# Altium project RheoBoard_v7.PrjPcb (part 2 of 2)
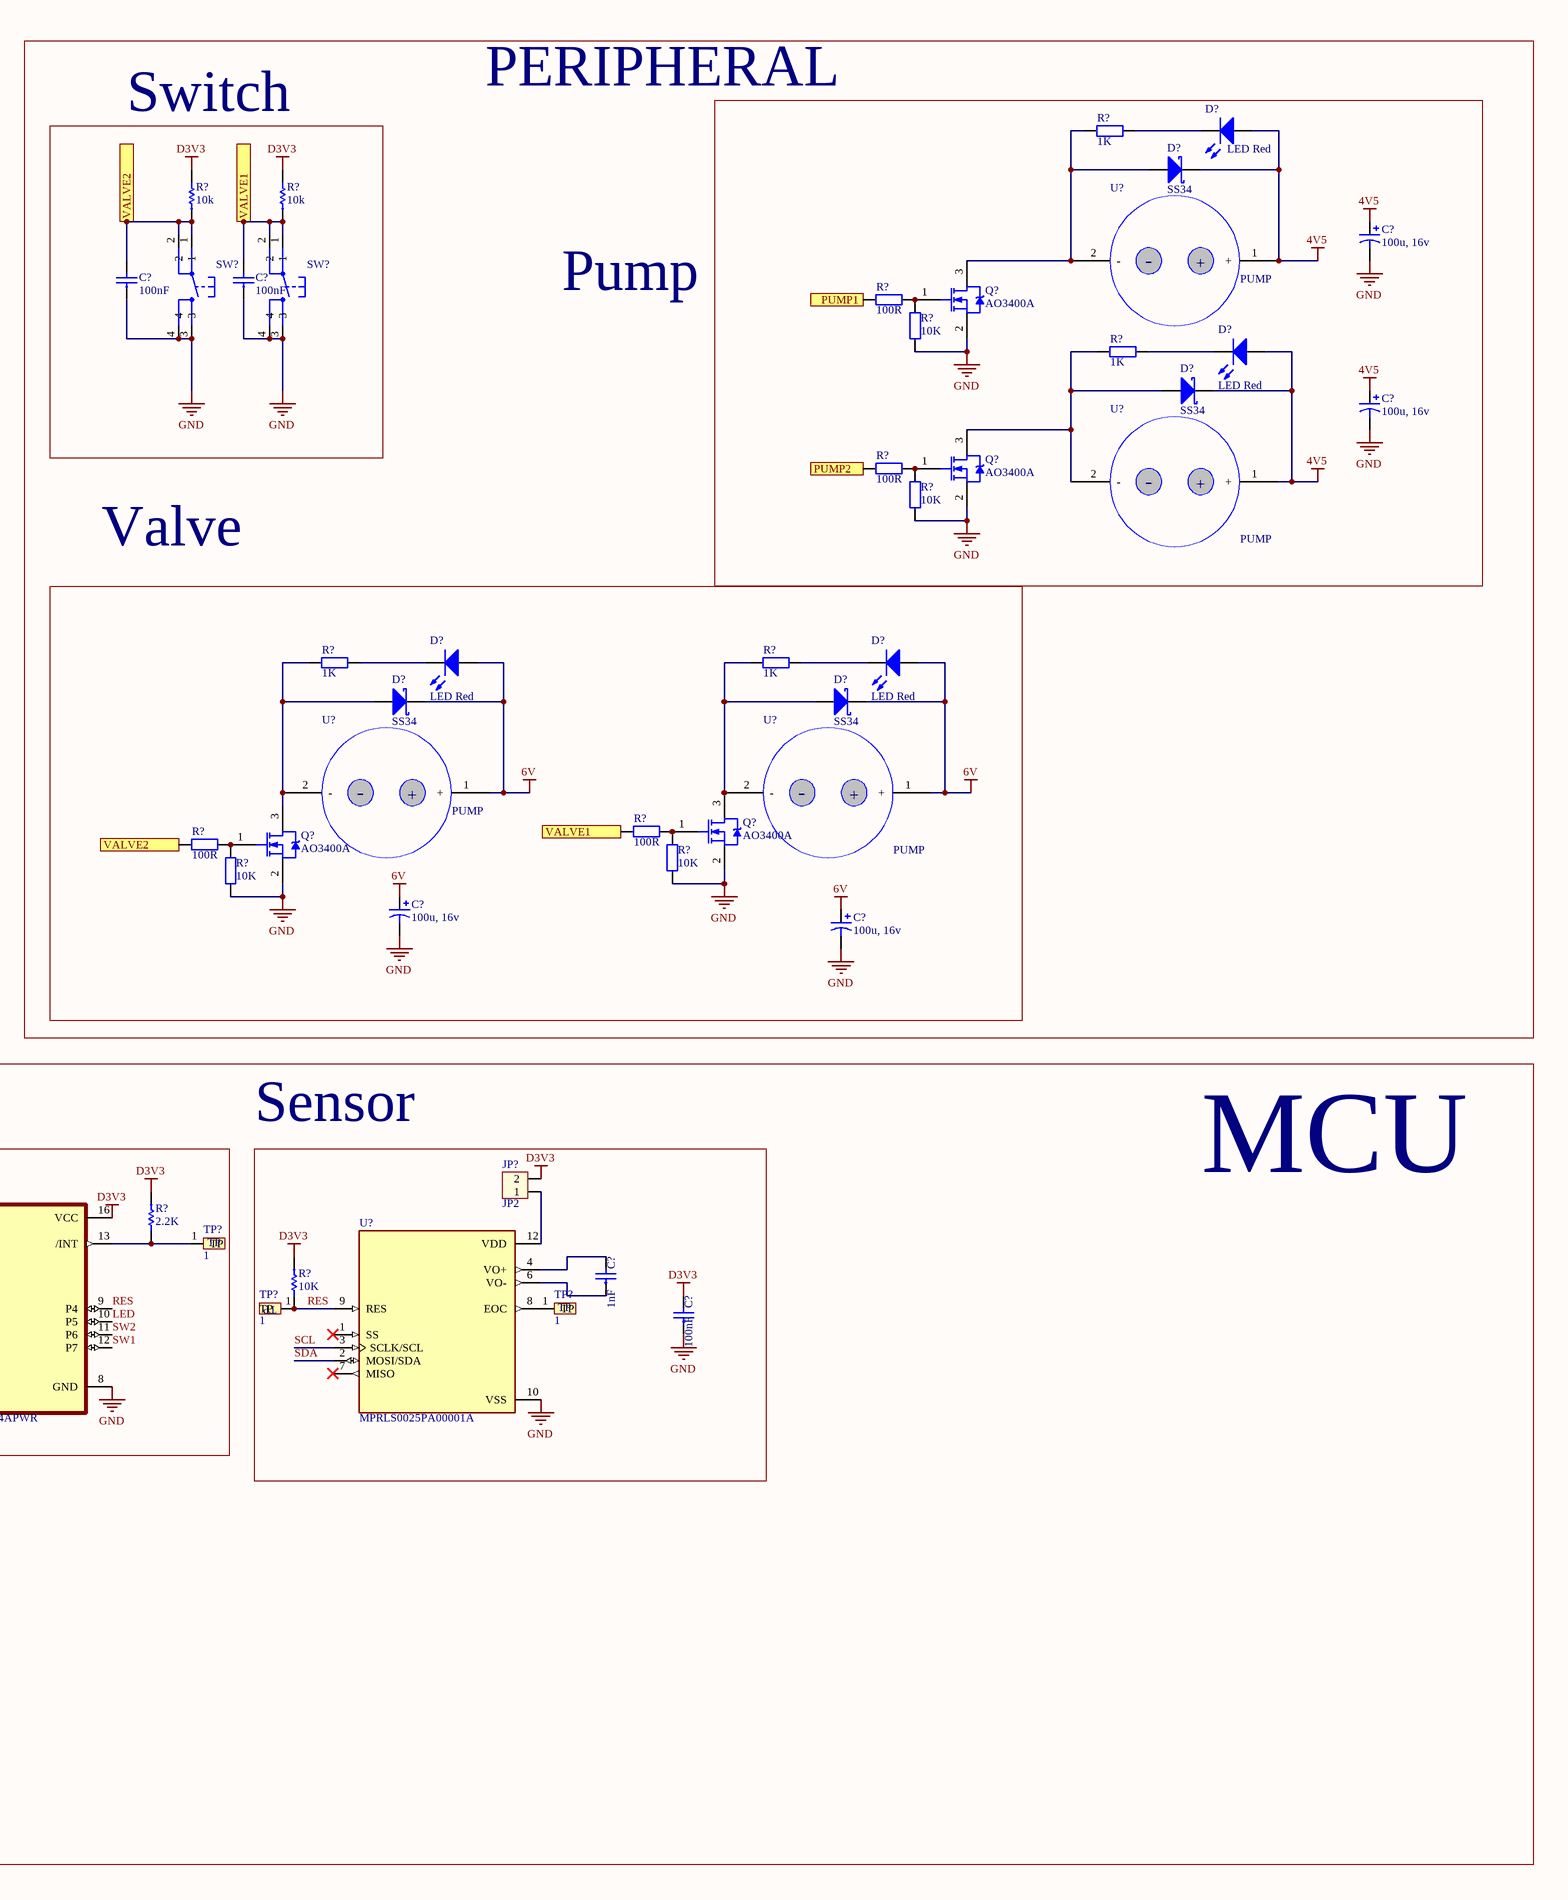
[diagram p5: schematic1.SchDoc, right]

## Nets that join several sheets
3V3: POWER (C17.2 C18.2 FB3.1 U3.5), schematic1 (C?#21.2 C?#22.2 FB?.1 U?#7.5)
4V5: POWER (7 pins), PERIPHERAL (8 pins), schematic1 (15 pins)
4V5A: POWER (5 pins), schematic1 (5 pins)
6V: POWER (6 pins), PERIPHERAL (8 pins), schematic1 (14 pins)
+12: POWER (D11.1 JDC1.1), schematic1 (D?#3.1 JDC?.1)
D3V3: POWER (C19.2 C20.1 FB3.2), MCU (18 pins), PERIPHERAL (R18.2 R19.2), schematic1 (23 pins)
GND: POWER (23 pins), MCU (16 pins), PERIPHERAL (18 pins), schematic1 (57 pins)
VIN: POWER (9 pins), schematic1 (9 pins)
NetC26_2: MCU (U9.5), PERIPHERAL (5 pins), schematic1 (6 pins)
NetC29_2: MCU (U9.6), PERIPHERAL (5 pins), schematic1 (6 pins)
NetR10_1: MCU (U9.4), PERIPHERAL (R10.1), schematic1 (R?#5.1 U?#8.4)
NetR11_1: MCU (U9.7), PERIPHERAL (R11.1), schematic1 (R?#10.1 U?#8.7)